# Altium schematic sheet PWR.SchDoc: =DocumentName
size A3; CompanyName: "AS Manufacturing" LLC; Organization: "AS Manufacturing" LLC; Address1: 5 Sklyarenka St.; Address2: Kyiv 04073; Address3: Ukraine; Address4: https://ajax.systems/en/; SheetNumber: 1; SheetTotal: 1; Template_version: 1.0.1
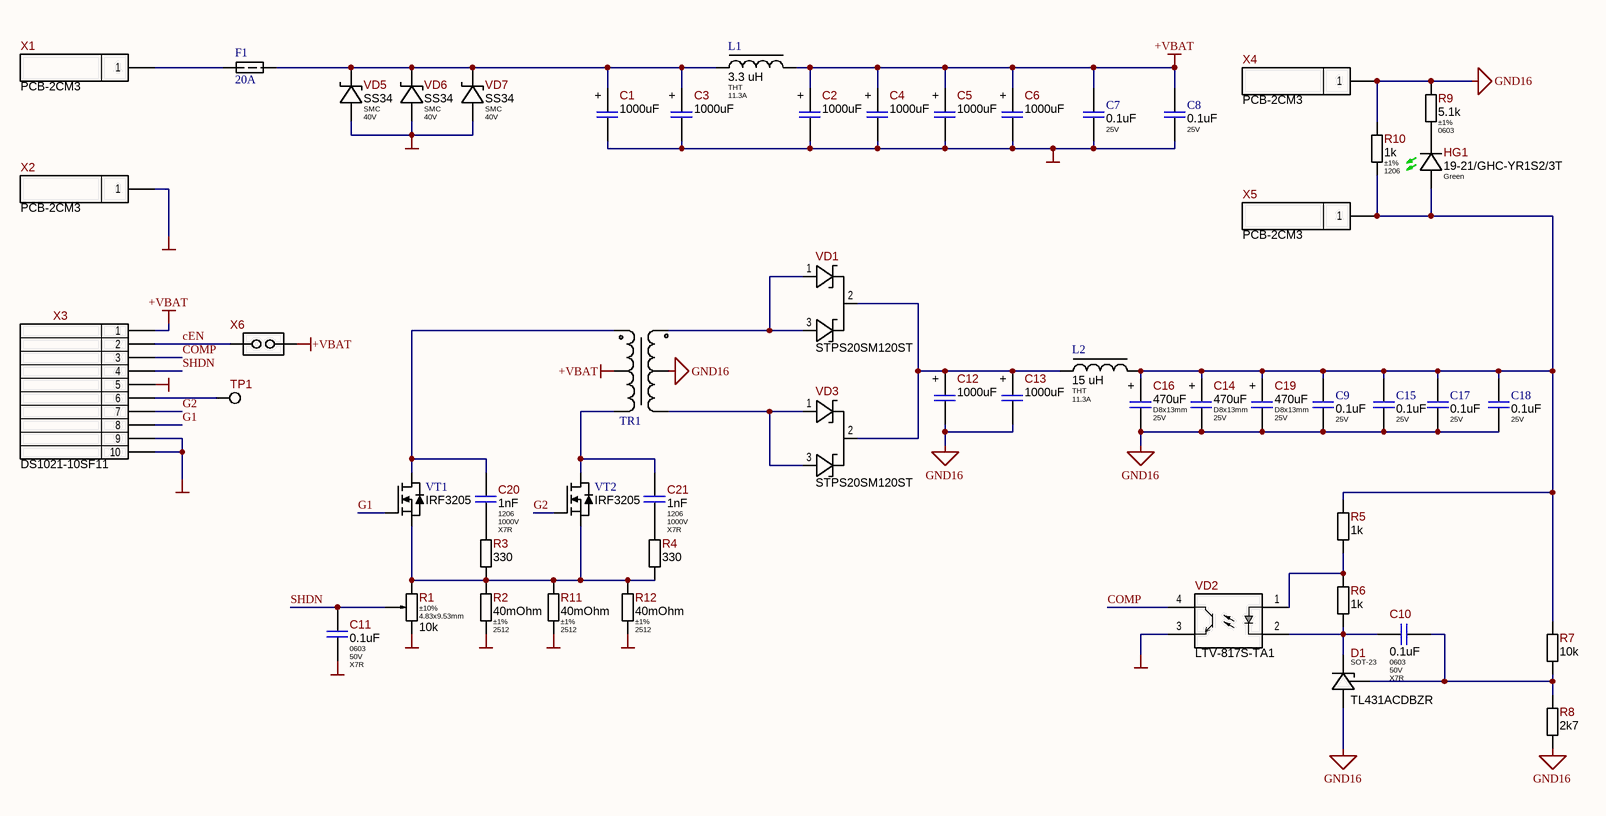
[diagram p0: PWR.SchDoc]

## Parts
C1  value 1000uF  [CAP-AE-PTH-100D05x200H20]  (hidden comment: 1000uFx25V)
C2  value 1000uF  [CAP-AE-PTH-100D05x200H20]  (hidden comment: 1000uFx25V)
C3  value 1000uF  [CAP-AE-PTH-100D05x200H20]  (hidden comment: 1000uFx25V)
C4  value 1000uF  [CAP-AE-PTH-100D05x200H20]  (hidden comment: 1000uFx25V)
C5  value 1000uF  [CAP-AE-PTH-100D05x200H20]  (hidden comment: 1000uFx25V)
C6  value 1000uF  [CAP-AE-PTH-100D05x200H20]  (hidden comment: 1000uFx25V)
C7  value 0.1uF  Voltage: 25V  [CAP: MKS2 (W=2.50MM)]  (hidden comment: *uF)
C8  value 0.1uF  Voltage: 25V  [CAP: MKS2 (W=2.50MM)]  (hidden comment: *uF)
C9  value 0.1uF  Voltage: 25V  [CAP: MKS2 (W=2.50MM)]  (hidden comment: *uF)
C10  Package: 0603  Voltage: 50V  Dielectric Type: X7R  [C_CERAMIC_0603_MED]  (hidden comment: 0.1uF)
C11  Package: 0603  Voltage: 50V  Dielectric Type: X7R  [C_CERAMIC_0603_MED]  (hidden comment: 0.1uF)
C12  value 1000uF  [CAP-AE-PTH-100D05x200H20]  (hidden comment: 1000uFx25V)
C13  value 1000uF  [CAP-AE-PTH-100D05x200H20]  (hidden comment: 1000uFx25V)
C14  value 470uF  Package: D8x13mm  Voltage: 25V  [CAP-AE-PTH-80D05x130H15]  (hidden comment: 470uFx25V)
C15  value 0.1uF  Voltage: 25V  [CAP: MKS2 (W=2.50MM)]  (hidden comment: *uF)
C16  value 470uF  Package: D8x13mm  Voltage: 25V  [CAP-AE-PTH-80D05x130H15]  (hidden comment: 470uFx25V)
C17  value 0.1uF  Voltage: 25V  [CAP: MKS2 (W=2.50MM)]  (hidden comment: *uF)
C18  value 0.1uF  Voltage: 25V  [CAP: MKS2 (W=2.50MM)]  (hidden comment: *uF)
C19  value 470uF  Package: D8x13mm  Voltage: 25V  [CAP-AE-PTH-80D05x130H15]  (hidden comment: 470uFx25V)
C20  value 1nF  Package: 1206  Voltage: 1000V  Dielectric Type: X7R  [C_CERAMIC_1206_MED]  (hidden comment: 100nF)
C21  value 1nF  Package: 1206  Voltage: 1000V  Dielectric Type: X7R  [C_CERAMIC_1206_MED]  (hidden comment: 100nF)
D1  Package: SOT-23  [SOT-23_MED]  (hidden comment: TL431ACDBZR)
F1  20A  [MINI_FUSE]
HG1  Color: Green  [LED-0603G-0.8mm]  (hidden comment: 19-21/GHC-YR1S2/3T)
L1  value 3.3 uH  Package: THT  Current: 11.3A  [DROD0625V-18-1.12]  (hidden comment: 3.3uH)
L2  value 15 uH  Package: THT  Current: 11.3A  [IND: R22.9/14/7.62 (H)]  (hidden comment: 15uH - 11A)
R1  Tolerance: ±10%  Package: 4.83x9.53mm  [3296W-1-xxx]  (hidden comment: 10k)
R2  Tolerance: ±1%  Package: 2512  [CRA2512-Series]  (hidden comment: 40mOhm)
R3  330  [R_ANY_CHIP_1206_MED]
R4  330  [R_ANY_CHIP_1206_MED]
R5  1k  [R_ANY_CHIP_0805_MED]
R6  1k  [R_ANY_CHIP_0805_MED]
R7  10k  [R_ANY_CHIP_0805_MED]
R8  2k7  [R_ANY_CHIP_0805_MED]
R9  Tolerance: ±1%  Package: 0603  [R_ANY_CHIP_0603_MED]  (hidden comment: 5.1k)
R10  Tolerance: ±1%  Package: 1206  [R_ANY_CHIP_1206_MED]  (hidden comment: 1k)
R11  Tolerance: ±1%  Package: 2512  [CRA2512-Series]  (hidden comment: 40mOhm)
R12  Tolerance: ±1%  Package: 2512  [CRA2512-Series]  (hidden comment: 40mOhm)
TP1  PAD-1.1mm  [PAD-1.1mm]  (value not drawn)  (no BOM)
TR1  TR  [TR: R32.8/20.1/10.7 (L) - MINPOINT- 2]  (value not drawn)
VD1  STPS20SM120ST  [TO220(H)]
VD2  LTV-817S-TA1  [LTV-817S-TA1_REC]
VD3  STPS20SM120ST  [TO220(H)]
VD5  Voltage: 40V  [SMC]  (hidden comment: SS34)
VD6  Voltage: 40V  [SMC]  (hidden comment: SS34)
VD7  Voltage: 40V  [SMC]  (hidden comment: SS34)
VT1  Part Number: IRF3205  [TO220(H)]  (hidden comment: AOD403)
VT2  Part Number: IRF3205  [TO220(H)]  (hidden comment: AOD403)
X1  PCB-2CM3  [CON: 8191]
X2  PCB-2CM3  [CON: 8191]
X3  PLS-10 (Part of PLS-40)  [DS1021-10S]  (value not drawn)
X4  PCB-2CM3  [CON: 8191]
X5  PCB-2CM3  [CON: 8191]
X6  PLS-2R U-Type  [DS1022-1x2RUx1]  (value not drawn)

## Nets
+VBAT: C2.1 C4.1 C5.1 C6.1 C7.1 C8.1 L1.2 TR1.3 X3.1 X6.1
GND: C1.2 C2.2 C3.2 C4.2 C5.2 C6.2 C7.2 C8.2 C11.2 R1.1(CCW) R2.2 R11.2 R12.2 VD2.3(Emitter) VD5.AN VD6.AN VD7.AN X2.1 X3.5 X3.9 X3.10
GND16: C9.2 C12.2 C13.2 C14.2 C15.2 C16.2 C17.2 C18.2 C19.2 D1.3(A) R8.1 R9.1 R10.1 TR1.6 X4.1
cEN: X3.2 X6.2
COMP: VD2.4(Collector) X3.3
G1: VT1.1(G) X3.8
G2: VT2.1(G) X3.7
SHDN: C11.1 R1.2(WIPER) X3.4
NetC1_1: C1.1 C3.1 F1.2 L1.1 VD5.CA VD6.CA VD7.CA
NetC9_1: C9.1 C14.1 C15.1 C16.1 C17.1 C18.1 C19.1 HG1.AN(Anode) L2.2 R5.2 R7.2 R10.2 X5.1
NetC10_1: C10.1 D1.1(C) R6.1 VD2.2(Cathode)
NetC10_2: C10.2 D1.2(REF) R7.1 R8.2
NetC12_1: C12.1 C13.1 L2.1 VD1.2(Cathode) VD3.2(Cathode)
NetC20_1: C20.1 TR1.1 VT1.2(D)
NetC20_2: C20.2 R3.1
NetC21_1: C21.1 TR1.2 VT2.2(D)
NetC21_2: C21.2 R4.1
NetF1_1: F1.1 X1.1
NetHG1_CA: HG1.CA(Cathode) R9.2
NetR1_3: R1.3(CW) R2.1 R3.2 R4.2 R11.1 R12.1 VT1.3(S) VT2.3(S)
NetR5_1: R5.1 R6.2 VD2.1(Anode)
NetTP1_1: TP1.1 X3.6
NetTR1_4: TR1.4 VD1.1(Anode_1) VD1.3(Anode_2)
NetTR1_5: TR1.5 VD3.1(Anode_1) VD3.3(Anode_2)

## Notes on the sheet
- Title
- Product:
- Project:
- Size:
- Date:
- Variant:
- A3
- Authors:
- Time:
- Sheet
- of
- Revision:
- Commit:
- (in symbol ESH108M025AH4AA) +
- (in symbol KS-025V471MF130) +

## Library data of the parts
C1-C6 C12 C13 = ESH108M025AH4AA: 1000uF 25V ±20% Aluminum Electrolytic Capacitors Radial, 2000 Hrs @ 105°C, 740mA Ripple Current; Manufacturer: Kemet; Ajax_1C_PN: NONE; Ajax_1С_Status: RND Only; Standard Lead Time: 30 Weeks; Component Status: Released; Package: D10x20mm; Voltage: 25V; Part Number: ESH108M025AH4AA; Part Type: Aluminum; Component Type: PTH; Temperature Range: -40°C ~ 105°C; Tolerance: ±20%; Dielectric Type: NONE; ComponentLink1URL: https://eu.mouser.com/datasheet/2/212/KEM_A4005_ESH-1101279.pdf; Supplier 1: Mouser; Supplier Part Number 1: 80-ESH108M025AH4AA; Replacement: NONE; Price: NONE; ComponentLink1Description: Datasheet
C7-C9 C15 C17 C18 = CAP_NON_POLAR_THT: Multilayer Ceramic Capacitors MLCC - SMD/SMT 10 uF 25 VDC 10% 1206 X7R; Manufacturer: Murata; Part Number: GRM31CR71E106KA12L; ComponentLink1Description: Datasheet; ComponentLink1URL: https://eu.mouser.com/datasheet/2/281/1/GRM31CR71E106KA12_01CA-1987921.pdf; Tolerance: 10 %; Component Type: THT; Package: 1206
C10 C11 = CL10B104KB8NNNC: 100nF 50V X7R ±10% 0603 Ceramic Capacitor RoHS; Manufacturer: Samsung Electro-Mechanics; Ajax_1C_ID: 15653; Ajax_1C_PN: 100nF 50V X7R 10% 0603 CL10B104KB8NNNC ceramic capacitor SMD; Ajax_1С_Status: Mass Production; Standard Lead Time: 18 Weeks; Component Status: Released; Replacement: CL10B104KB8NNND; GUID_1C: 28d36f8f-5d05-11e9-ab4e-0050569f2651; Value: 0.1uF; Part Number: CL10B104KB8NNNC; Part Type: Ceramic / X7R / 0603; Component Type: SMD; Temperature Range: -55°C ~ 125°C; Tolerance: ±10%; ComponentLink1URL: https://media.digikey.com/pdf/Data%20Sheets/Samsung%20PDFs/CL_Series_MLCC_ds.pdf; Supplier 1: Digi-Key; Supplier Part Number 1: 1276-1000-2-ND; Price: 0.00273; ComponentLink1Description: Datasheet
C14 C16 C19 = KS-025V471MF130: 470uF 25V ±20% D8x13mm Conductive Polymer Aluminum Solid Capacitor, 2000 Hrs @ 105°C, 4100mA Ripple Current; Manufacturer: Koshin; Ajax_1C_ID: 45913; Ajax_1C_PN: 470uF 25V 20% Low ESR 8x13mm (KS-025V471MF130 - Koshin) Aluminium Capacitors; Ajax_1С_Status: Mass Production; Component Status: Released; Dielectric Type: NONE; GUID_1C: 2652f362-010b-11ed-a361-005056994834; Part Number: KS-025V471MF130; Part Type: Aluminum; Component Type: PTH; Temperature Range: -55°C ~ 105°C; Tolerance: ±20%; ComponentLink1URL: \\altiumdb.ajax.local\files\Datasheet\Capacitor\KS-Series.pdf; Replacement: NONE; Price: 0.07; ComponentLink1Description: Datasheet
C20 C21 = 1206B102K102CG: 1nF 1000V X7R ±10% 1206 Ceramic Capacitor RoHS; Manufacturer: Walsin; Ajax_1C_ID: 35059; Ajax_1C_PN: 1nF 1000V X7R 10% 1206 1206B102K102CG Walsin Ceramic Capacitor SMD RoHS; Ajax_1С_Status: Substitution; Standard Lead Time: 31 Weeks; Component Status: Released; Replacement: NONE; GUID_1C: 1a19ac0a-26a3-11ec-ab76-0050569f2651; Part Number: 1206B102K102CG; Part Type: Ceramic / X7R / 1206; Component Type: SMD; Temperature Range: -55°C ~ 125°C; Tolerance: ±10%; ComponentLink1URL: https://eu.mouser.com/datasheet/2/210/Middle_and_High_Voltage_DS-1535659.pdf; Supplier 1: Mouser; Supplier Part Number 1: 791-1206B102K102CT; Price: 0; ComponentLink1Description: Datasheet
D1 = TL431ACDBZR: Adjustable Precision Shunt Regulator, Accuracy 1%,  SOT-23-3; Manufacturer: Texas Instruments; Ajax_1C_ID: 6287; Ajax_1C_PN: TL431ACDBZR (SOT-23); Ajax_1С_Status: Mass Production; Standard Lead Time: 8 Weeks; Component Status: Released; Replacement: NONE; GUID_1C: b426e85d-df70-11e4-9f89-a45d36c4a9e5; Part Number: TL431ACDBZR; Part Type: Voltage Reference; Component Type: SMD; Temperature Range: 0°C ~ 70°C; ComponentLink1URL: https://www.ti.com/lit/ds/symlink/tl431.pdf; Supplier 1: Digi-Key; Supplier Part Number 1: 296-17328-1-ND; Price: 0.046; ComponentLink1Description: Datasheet
F1 = MINI_FUSE: Fuse MAXI Size; Manufacturer_Name: LITTELFUSE; Manufacturer_Part_Number: 17861640001; Datasheet Link: https://www.littelfuse.com/media?resourcetype=2d-prints&itemid=dcb90cf3-0771-4ccd-8726-26101cf00574&filename=ol-178.6164.0000(c); Height: 17.5mm
HG1 = 19-21/GHC-YR1S2/3T: Indication LED, Green 528nm, Clear, SMD 0603, Vf 2.7-3.7V, 112 - 285mcd @ 20mA, 110°; Manufacturer: Everlight Electronics; Ajax_1C_ID: 43621; Ajax_1C_PN: 19-21/GHC-YR1S2/3T, Green Indication LED; Ajax_1С_Status: RND Only; Component Status: Released; Replacement: NONE; GUID_1C: 5cbdcee5-e010-11ec-a361-005056994834; Part Type: LED / 0603; Component Type: SMD; Package: 0603; Wavelength: 528nm; Temperature Range: -40°C ~ 85°C; ComponentLink1URL: https://media.digikey.com/pdf/Data%20Sheets/Everlight%20PDFs/19-21-GHC-YR1S2-3T.pdf; Supplier 1: Digi-Key; Supplier Part Number 1: 19-21/GHC-YR1S2/3T-ND; Price: 0.038; ComponentLink1Description: Datasheet; Part Number: 19-21/GHC-YR1S2/3T; Lifecycle: Not Recommended
L1 = DROD0625V-18-1.12: Дросель з магазину Coretech; Manufacturer: Bourns Inc.; Part Number: RLB0914-3R3ML-ND; Tolerance: ±20%; ComponentLink1Description: Datasheet; ComponentLink1URL: https://www.vishay.com/docs/34193/ihlp-4040dz-01.pdf; Saturation Current: 11.3A
L2 = IND_TOROIDAL: Manufacturer: Bourns Inc.; Part Number: RLB0914-3R3ML-ND; Saturation Current: 14.4; Tolerance: ±20%; ComponentLink1Description: Datasheet; ComponentLink1URL: https://www.vishay.com/docs/34193/ihlp-4040dz-01.pdf
R1 = 3296W-1-103LF: 10 kOhms ±10% Trimmer Resistor, 0.5W, Through Hole 3/8", 4.83x9.53mm, 10.03mm Height; Manufacturer: Bourns; Ajax_1C_ID: 93647; Ajax_1C_PN: 3296W-1-103LF 10k 10% потенціометр Bourns; Ajax_1С_Status: RND Only; Component Status: Released; Temperature Stability: ±100ppm/°C; Replacement: NONE; GUID_1C: 97641684-c416-11ee-b96d-00505699fadc; Value: 10k; Part Number: 3296W-1-103LF; Component Type: PTH; Part Type: Trimming Potentiometer; Power Rating: 0.5W; Temperature Range: -55°C ~ 125°C; ComponentLink1URL: https://www.bourns.com/data/global/pdfs/3296.pdf; Supplier 1: Mouser; Supplier Part Number 1: 652-3296W-1-103LF; Price: 0.17925015; ComponentLink1Description: Datasheet
R2 R11 R12 = CRA2512-FZ-R030ELF: 30 mOhms ±1%, 3W 2512 Metal Strip Current Sense Chip Resistor; Manufacturer: Bourns; Ajax_1C_ID: 49526; Ajax_1C_PN: 0.03R 1% 3W 2512 50ppm CRA2512-FZ-R030ELF Bourns Metal Strip Current Sense Resistors SMD RoHS; Ajax_1С_Status: RND Only; Voltage: NONE; Component Status: Released; Temperature Stability: ±50ppm/°C; GUID_1C: 1387118b-2e85-11ed-a363-005056994834; Value: 40mOhm; Part Number: CRA2512-FZ-R030ELF; Component Type: SMD; Part Type: Metal Element, Strip; Power Rating: 3W; Temperature Range: -55°C ~ 170°C; ComponentLink1URL: https://eu.mouser.com/datasheet/2/54/cra-1862173.pdf; Supplier 1: Mouser; Supplier Part Number 1: 652-CRA2512FZR030ELF; Replacement: NONE; Price: 0.199; ComponentLink1Description: Datasheet
R3 R4 R10 = CRCW120675R0FKEAC: 75 Ohms ±1%, 1/4W 1206 Thick Film Resistor; Manufacturer: Vishay; Ajax_1C_ID: 51096; Ajax_1C_PN: _75R 1% 1206 Thick Film Resistor RoHS; Ajax_1С_Status: RND Only; Power Rating: 0.25W; Voltage: 200V; Component Status: Released; Temperature Stability: ±100ppm/°C; Replacement: NONE; GUID_1C: df68862c-4098-11ed-a363-005056994834; Part Number: CRCW120675R0FKEAC; Component Type: SMD; Part Type: Thick Film; Temperature Range: -55°C ~ 155°C; ComponentLink1URL: https://eu.mouser.com/datasheet/2/427/crcwce3-1762584.pdf; Supplier 1: Mouser; Supplier Part Number 1: 71-CRCW120675R0FKEAC; Price: 0; ComponentLink1Description: Datasheet
  R3 R4: Tolerance: ±1%; Package: 1206; Value: 330
  R10: Value: 1k
R5 R6 R8 = RC0805JR-0722RL: 22 Ohms ±5%, 1/8W 0805 Thick Film Resistor; Manufacturer: Yageo; Ajax_1C_ID: 8822; Ajax_1C_PN: 22R 5% 0805 Resistors SMD RoHS; Ajax_1С_Status: Mass Production; Power Rating: 0.125W; Voltage: 150V; Component Status: Released; Temperature Stability: ±100ppm/°C; Replacement: NONE; GUID_1C: 3ba40fec-5951-11e6-81ec-d8cb8a9acc66; Tolerance: ±5%; Package: 0805; Part Number: RC0805JR-0722RL; Component Type: SMD; Part Type: Thick Film; Temperature Range: -55°C ~ 155°C; ComponentLink1URL: https://eu.mouser.com/datasheet/2/447/PYu_RC_Group_51_RoHS_L_10-1664068.pdf; Price: 0.0011; ComponentLink1Description: Datasheet
  R5 R6: Value: 1k
  R8: Value: 2k7
R7 = RC0805JR-0722RL: Manufacturer: Yageo; Tolerance: ±5%; Ajax_1C_ID: 8822; Ajax_1C_PN: 22R 5% 0805 Resistors SMD RoHS; Ajax_1С_Status: Mass Production; Power Rating: 0.125W; Voltage: 150V; Component Status: Released; Temperature Stability: ±100ppm/°C; Replacement: NONE; GUID_1C: 3ba40fec-5951-11e6-81ec-d8cb8a9acc66; Package: 0805; Value: 10k; Part Number: RC0805JR-0722RL; Component Type: SMD; Part Type: Thick Film; Temperature Range: -55°C ~ 155°C; ComponentLink1URL: https://eu.mouser.com/datasheet/2/447/PYu_RC_Group_51_RoHS_L_10-1664068.pdf; Price: 0.0011; ComponentLink1Description: Datasheet
R9 = RC0603FR-075K1L: 5.1 kOhms ±1%, 1/10W 0603 Thick Film Resistor; Manufacturer: Yageo; Ajax_1C_PN: NONE; Ajax_1С_Status: RND Only; Power Rating: 0.1W; Voltage: 75V; Component Status: Released; Temperature Stability: ±100ppm/°C; Value: 5.1k; Part Number: RC0603FR-075K1L; Component Type: SMD; Part Type: Thick Film; Temperature Range: -55°C ~ 155°C; ComponentLink1URL: https://eu.mouser.com/datasheet/2/447/PYu_RC_Group_51_RoHS_L_11-1984063.pdf; Supplier 1: Digi-Key; Supplier Part Number 1: 311-5.10KHRTR-ND; Replacement: NONE; Price: NONE; ComponentLink1Description: Datasheet
TP1 = PAD-1.1mm: 1.1mm Pad for Plug-In or Receptacle; Ajax_1C_PN: NONE; Ajax_1С_Status: RND Only; Component Status: Released; Part Number: PAD-1.1mm; Component Type: PTH; Manufacturer: NONE; Part Type: Pad; Temperature Range: NONE; ComponentLink1URL: NONE; Replacement: NONE; Price: NONE; ComponentLink1Description: Datasheet
TR1 = Toroidal Transformator Midpoint_1: Manufacturer: Handmade; Part Number: RLB0914-3R3ML-ND; Saturation Current: 11.3A; Tolerance: ±20%; ComponentLink1Description: Datasheet; ComponentLink1URL: https://www.vishay.com/docs/34193/ihlp-4040dz-01.pdf
VD1 VD3 = DIODE SCHOTTKY DUAL: Diode Schottky Array 1 Pair Common Cathode, 120V 20A, TO-220; Manufacturer: STMicroelectronics; Component Status: Released; Standard Lead Time: 11 Weeks; Vf: 0.75V @ 10A; Replacement: NONE; Voltage: 120V; Part Type: Schottky; Component Type: PTH; Marking: STPS20SM120; Package: TO-220AB; Current: 20A; Temperature Range: -65°C ~ 150°C; ComponentLink1URL: https://www.st.com/resource/en/datasheet/stps20sm120s.pdf; Supplier 1: Digi-Key; Supplier Part Number 1: 497-15563-5-ND; Price: NONE; ComponentLink1Description: Datasheet; Part Number: STPS20SM120ST
VD2 = LTV-817S-TA1: 1-Channel Photocoupler, 5kV, SSOP-4; Manufacturer: Lite-On Optoelectronics; Ajax_1C_ID: 12260; Ajax_1C_PN: LTV-817S-TA1 оптопара; Ajax_1С_Status: Mass Production; Component Status: Released; Wavelength: NONE; Replacement: LTV-816S-TA1; GUID_1C: 36a51d61-3103-11e8-822a-14dda9d2d04d; Part Number: LTV-817S-TA1; Part Type: Optocoupler; Component Type: SMD; Package: SSOP-4; Color: NONE; Temperature Range: -55°C ~ 110°C; ComponentLink1URL: https://optoelectronics.liteon.com/upload/download/DS-70-96-0016/LTV-8X7%20series%20201610%20.pdf; Supplier 1: Digi-Key; Supplier Part Number 1: 160-1893-2-ND; Price: 0.053; ComponentLink1Description: Datasheet
VD5-VD7 = SS34: Diode Schottky 40V 3A, SMC; Manufacturer: Onsemi; Ajax_1C_ID: 5516; Ajax_1C_PN: SS34 Schottky Diode 3A 40V SMC; Ajax_1С_Status: Mass Production; Component Status: Released; Standard Lead Time: 14 Weeks; Vf: 500mV @ 3A; Replacement: NONE; GUID_1C: cad02570-6b2e-11e4-9c1d-a45d36c4a9e5; Part Number: SS34; Package: SMC; Part Type: Schottky; Component Type: SMD; Marking: SS34; Current: 3A; Temperature Range: -55°C ~ 150°C; ComponentLink1URL: https://www.onsemi.com/pdf/datasheet/ss39-d.pdf; Supplier 1: Digi-Key; Supplier Part Number 1: SS34FSCT-ND; Price: 0.03; ComponentLink1Description: Datasheet
VT1 VT2 = N-CH_MOSFET: N-MOSFET; полевой;; Part Type: N-Channel; Component Type: SMD; Package: D-PAK; ComponentLink1Description: Datasheet; ComponentLink1URL: https://www.tme.eu/Document/dd9e9fcbccf7c5b1f5f9da06cbc5bf44/AOD403-DTE.pdf; ComponentLink2Description: imrad; ComponentLink2URL: https://imrad.com.ua/ua/aod403-7?srsltid=AfmBOoqbv76D2b_UWMskTCTCmXEIhcjdT6a5VOgt9k0M-VKdEIqWTw9d
X1 X2 X4 X5 = PCB-2CM3: Гвинтова клема для друкарського монтажу, 40 А / Матеріал - латунь луджена 0.8 мм, гвинт в комплекті.  Піни 5x7mm; Manufacturer: China; Component Status: Review_1; Replacement: NONE; Part Type: Terminal / Pluggable; Component Type: PTH; Temperature Range: -40°C ~ 105°C; Supplier 1: TME; Supplier Part Number 1: 15EDGVC-3.5-02P; Price: NONE; ComponentLink2Description: VORON; ComponentLink2URL: https://voron.ua/uk/catalog/022944--klemma_vintovaya_pcb-2cm3; Part Number: PCB-2CM3
X3 = DS1021-10SF11: 10 Pin 2.54mm Male Header, Vertical, 3mm and 6.1mm, PLS-5; Manufacturer: Connfly; Ajax_1C_ID: 1215; Ajax_1C_PN: PLS40, планки со штырьками; Ajax_1С_Status: Mass Production; Component Status: Released; Replacement: NONE; Part Number: DS1021-10SF11; Part Type: Header / Male Pin / Single Row; Component Type: PTH; Temperature Range: -40°C ~ 105°C; ComponentLink1URL: \\altiumdb.ajax.local\files\Datasheet\Connectors\DS1021.pdf; Price: 0.001875; ComponentLink1Description: Datasheet
X6 = DS1022-1x2RUF1: 2 pin Male Header, Right Angle, 2.54mm, PTH, PLS-2R, U-type; Manufacturer: Connfly; Ajax_1C_PN: NONE; Ajax_1С_Status: RND Only; Component Status: On Review; Part Number: DS1022-1x2RUF1; Part Type: Header / Male Pin / Single Row / Right Angle; Component Type: PTH; Temperature Range: -40°C ~ 105°C; ComponentLink1URL: \\altiumdb.ajax.local\files\Datasheet\Connectors\DS1022.pdf; Replacement: NONE; Price: NONE; ComponentLink1Description: Datasheet